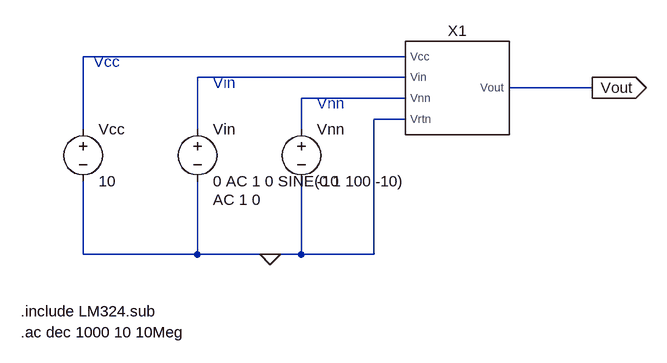
[diagram p0: schematic ACanalysis.asc]
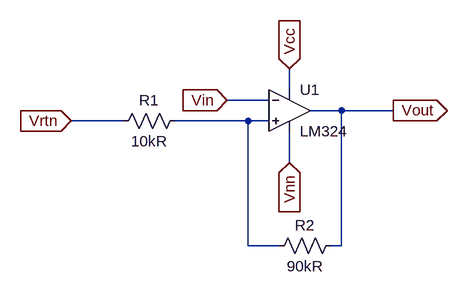
[diagram p1: sub-circuit invertingopamp.asc]
ACanalysis.asc, the LTspice schematic file:
Version 4.1
SHEET 1 928 680
WIRE 528 0 32 0
WIRE 528 32 208 32
WIRE 816 48 688 48
WIRE 528 64 368 64
WIRE 528 96 480 96
WIRE 32 112 32 0
WIRE 208 112 208 32
WIRE 368 112 368 64
WIRE 32 304 32 192
WIRE 208 304 208 192
WIRE 208 304 32 304
WIRE 320 304 208 304
WIRE 368 304 368 192
WIRE 368 304 320 304
WIRE 480 304 480 96
WIRE 480 304 368 304
FLAG 320 304 0
FLAG 816 48 Vout
IOPIN 816 48 Out
SYMBOL voltage 32 96 R0
WINDOW 123 0 0 Left 0
WINDOW 39 0 0 Left 0
SYMATTR InstName Vcc
SYMATTR Value 10
SYMBOL voltage 208 96 R0
WINDOW 123 24 124 Left 2
WINDOW 39 0 0 Left 0
SYMATTR InstName Vin
SYMATTR Value 0 AC 1 0 SINE(0 1 100 -10)
SYMATTR Value2 AC 1 0
SYMBOL voltage 368 96 R0
WINDOW 123 0 0 Left 0
WINDOW 39 0 0 Left 0
SYMATTR InstName Vnn
SYMATTR Value -10
SYMBOL InvertingOpamp 608 48 R0
SYMATTR InstName X1
TEXT 392 72 Left 2 ;Vnn
TEXT 232 40 Left 2 ;Vin
TEXT 48 8 Left 2 ;Vcc
TEXT -64 424 Left 2 !.ac dec 1000 10 10Meg
TEXT -64 392 Left 2 !.include LM324.sub

invertingopamp.asc, the sub-circuit schematic file:
Version 4.1
SHEET 1 880 680
WIRE 496 336 496 304
WIRE 464 352 400 352
WIRE 576 368 528 368
WIRE 656 368 576 368
WIRE 240 384 160 384
WIRE 432 384 320 384
WIRE 464 384 432 384
WIRE 496 448 496 400
WIRE 432 576 432 384
WIRE 480 576 432 576
WIRE 576 576 576 368
WIRE 576 576 560 576
FLAG 160 384 Vrtn
IOPIN 160 384 In
FLAG 400 352 Vin
IOPIN 400 352 In
FLAG 496 304 Vcc
IOPIN 496 304 In
FLAG 496 448 Vnn
IOPIN 496 448 In
FLAG 656 368 Vout
IOPIN 656 368 Out
SYMBOL res 336 368 R90
WINDOW 0 0 56 VBottom 2
WINDOW 3 32 56 VTop 2
SYMATTR InstName R1
SYMATTR Value 10kR
SYMBOL LM324 496 368 R0
SYMATTR InstName U1
SYMBOL res 576 560 R90
WINDOW 0 0 56 VBottom 2
WINDOW 3 32 56 VTop 2
SYMATTR InstName R2
SYMATTR Value 90kR

The netlist it stands for:
* ACanalysis.asc
Vcc N001 0 10
Vin N002 0 0 AC 1 0 SINE(0 1 100 -10) AC 1 0
Vnn N003 0 -10
X§X1 N001 N002 N003 0 Vout invertingopamp

* block symbol definitions
.subckt invertingopamp Vcc Vin Vnn Vrtn Vout
R1 N001 Vrtn 10kR
* U1: LM324 (symbol LM324 not available, pins judged from their places): In+=N001 In-=Vin V+=Vcc V-=Vnn OUT=Vout
R2 Vout N001 90kR
.ends invertingopamp

* Vnn
* Vin
* Vcc
.ac dec 1000 10 10Meg
.include LM324.sub
.backanno
.end